# Altium schematic sheet USB_C.SchDoc
size A4; SheetNumber: 3; SheetTotal: 8
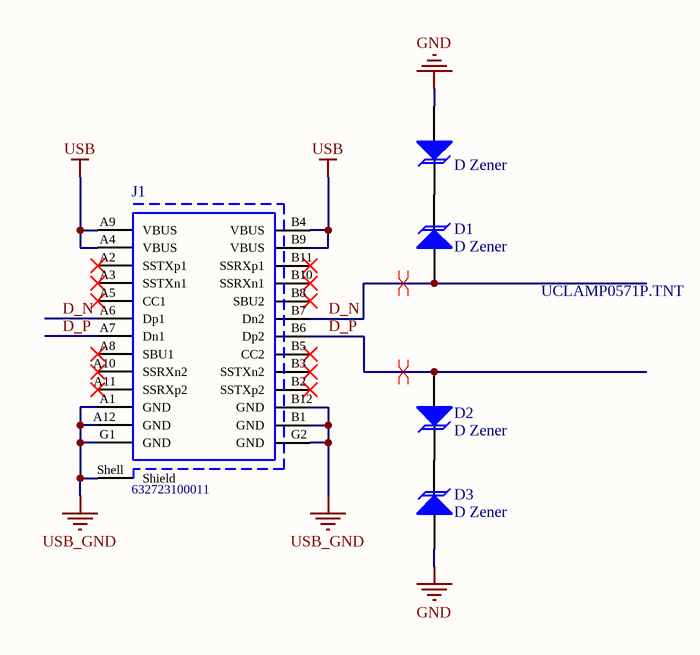
[diagram p0: USB_C.SchDoc]

## Parts
?  D Zener
D1  D Zener
D2  D Zener
D3  D Zener
J1  632723100011  [632723100011]

## Nets
GND: ?.1(A) D3.1(A)
USB: J1.A4(VBUS) J1.A9(VBUS) J1.B4(VBUS) J1.B9(VBUS)
USB_GND: J1.A1(GND) J1.A12(GND) J1.B1(GND) J1.B12(GND) J1.G1(GND) J1.G2(GND) J1.Shell(Shield)
D_N: D1.1(A) J1.A6(Dp1) J1.B7(Dn2)
D_P: D2.1(A) J1.A7(Dn1) J1.B6(Dp2)
Net?_2: ?.2(K) D1.2(K)
NetD2_2: D2.2(K) D3.2(K)

Not connected (* = marked no-connect by the designer): J1 A2(SSTXp1)* A3(SSTXn1)* A5(CC1)* A8(SBU1)* A10(SSRXn2)* A11(SSRXp2)* B2(SSTXp2)* B3(SSTXn2)* B5(CC2)* B8(SBU2)* B10(SSRXn1)* B11(SSRXp1)*

## Layout directives
differential pair: D_N, D_P

## Notes on the sheet
- UCLAMP0571P.TNT

## Library data of the parts
? D1-D3 = TVS (uni): TVS Diode; Published: 8-Jun-2000; LatestRevisionDate: 17-Jul-2002; LatestRevisionNote: Re-released for DXP Platform.; PackageReference: DIODE-0.7; Publisher: Altium Limited; PackageDescription: Diode, Thru-Hole; 2 Leads; 0.7 in Pin Spacing
J1 = CMP-1502-03213-1: USB 3.1 Type C Receptacle WR-COM, Horizontal, SMT / THT; Manufacturer: Wurth Elektronik; Working Voltage: 20VDC; Rated Current: 5A; Contact Resistance: 30mOhm; Operating Temperature: -40to105degC; Publisher: WurthElektronik; Gender: Receptacle; Part Number: 632723100011; Mounting Technology: SMT/THT; Datasheet URL: https://katalog.we-online.de/em/datasheet/632723x00011%282%29.pdf; Connector Type: USB3.1TypeC; Manufacturer URL: http://www.we-online.de; Orientation: Horizontal; Package Reference: 632723100011; Packaging: TapeandReel